# EAGLE schematic ledbord (EAGLE 9.6.0)
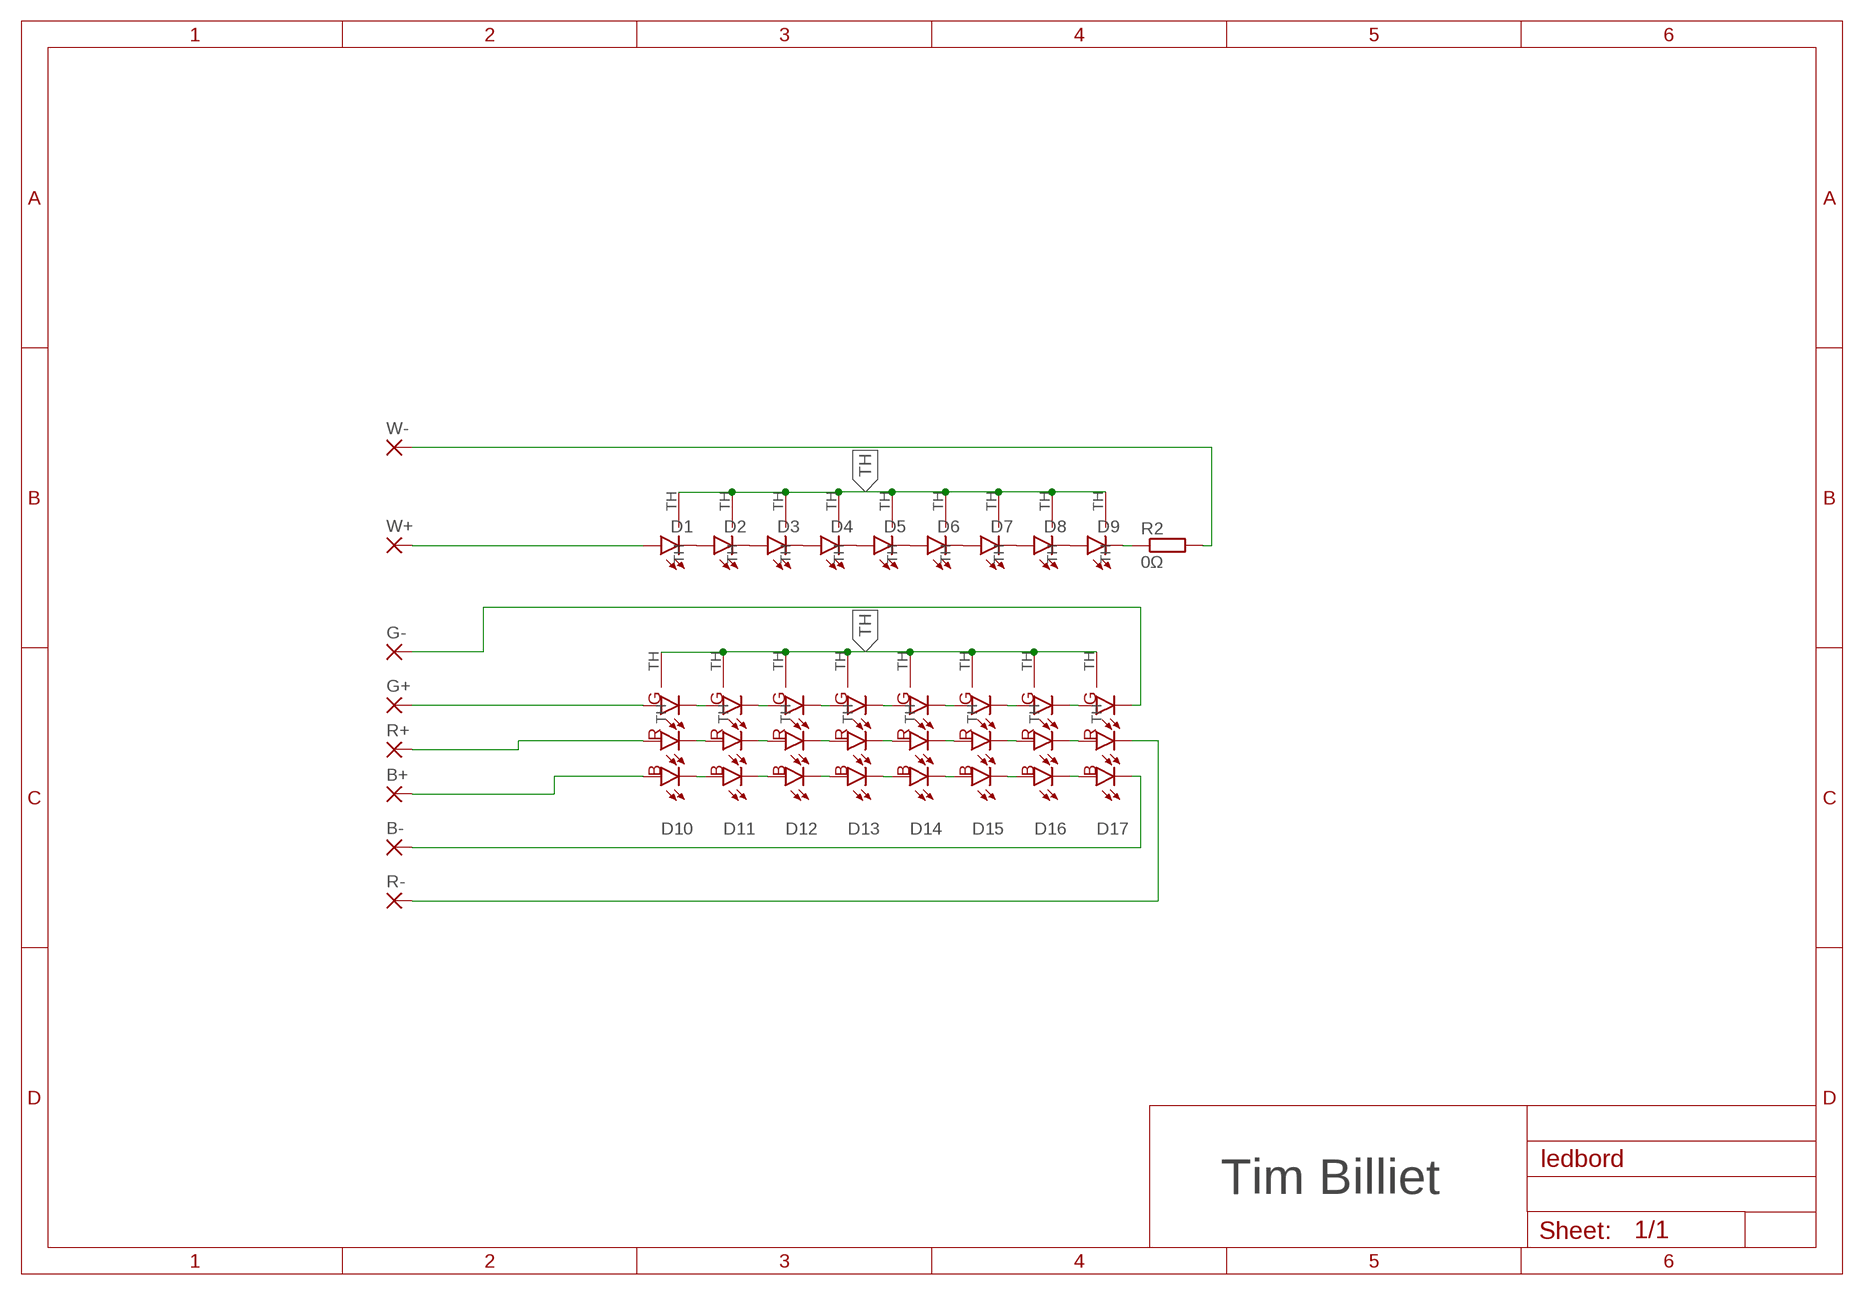
[diagram p0: schematic, sheet 1]

## Parts
B+  SMD5  [SMD2,54-5,08]
B-  SMD5  [SMD2,54-5,08]
D1  HL-C3535F77W1GA-LED  [HL-C3535F77W1GA-LED]
D2  HL-C3535F77W1GA-LED  [HL-C3535F77W1GA-LED]
D3  HL-C3535F77W1GA-LED  [HL-C3535F77W1GA-LED]
D4  HL-C3535F77W1GA-LED  [HL-C3535F77W1GA-LED]
D5  HL-C3535F77W1GA-LED  [HL-C3535F77W1GA-LED]
D6  HL-C3535F77W1GA-LED  [HL-C3535F77W1GA-LED]
D7  HL-C3535F77W1GA-LED  [HL-C3535F77W1GA-LED]
D8  HL-C3535F77W1GA-LED  [HL-C3535F77W1GA-LED]
D9  HL-C3535F77W1GA-LED  [HL-C3535F77W1GA-LED]
D10  TJ-S5050UGEW5TLCBRG-A5  [TJ-S5050UGEW5TLCBRG-A5]
D11  TJ-S5050UGEW5TLCBRG-A5  [TJ-S5050UGEW5TLCBRG-A5]
D12  TJ-S5050UGEW5TLCBRG-A5  [TJ-S5050UGEW5TLCBRG-A5]
D13  TJ-S5050UGEW5TLCBRG-A5  [TJ-S5050UGEW5TLCBRG-A5]
D14  TJ-S5050UGEW5TLCBRG-A5  [TJ-S5050UGEW5TLCBRG-A5]
D15  TJ-S5050UGEW5TLCBRG-A5  [TJ-S5050UGEW5TLCBRG-A5]
D16  TJ-S5050UGEW5TLCBRG-A5  [TJ-S5050UGEW5TLCBRG-A5]
D17  TJ-S5050UGEW5TLCBRG-A5  [TJ-S5050UGEW5TLCBRG-A5]
G+  SMD5  [SMD2,54-5,08]
G-  SMD5  [SMD2,54-5,08]
R2  0Ω  R-EU_R2512  [R2512]
R+  SMD5  [SMD2,54-5,08]
R-  SMD5  [SMD2,54-5,08]
W+  SMD5  [SMD2,54-5,08]
W-  SMD5  [SMD2,54-5,08]

## Nets
B+: B+.1(P) D10.P6(6B+)
B-: B-.1(P) D17.P1(1B-)
G+: D10.P4(4G+) G+.1(P)
G-: D17.P3(3G-) G-.1(P)
N$1: D1.P$2(C) D2.P$1(A)
N$2: D2.P$2(C) D3.P$1(A)
N$3: D3.P$2(C) D4.P$1(A)
N$4: D4.P$2(C) D5.P$1(A)
N$5: D5.P$2(C) D6.P$1(A)
N$6: D6.P$2(C) D7.P$1(A)
N$7: D7.P$2(C) D8.P$1(A)
N$8: D8.P$2(C) D9.P$1(A)
N$9: D10.P3(3G-) D11.P4(4G+)
N$10: D11.P3(3G-) D12.P4(4G+)
N$11: D12.P3(3G-) D13.P4(4G+)
N$12: D13.P3(3G-) D14.P4(4G+)
N$13: D14.P3(3G-) D15.P4(4G+)
N$14: D15.P3(3G-) D16.P4(4G+)
N$15: D15.P2(2R-) D16.P5(5R+)
N$16: D14.P2(2R-) D15.P5(5R+)
N$17: D13.P2(2R-) D14.P5(5R+)
N$18: D12.P2(2R-) D13.P5(5R+)
N$19: D11.P2(2R-) D12.P5(5R+)
N$20: D10.P2(2R-) D11.P5(5R+)
N$21: D10.P1(1B-) D11.P6(6B+)
N$22: D11.P1(1B-) D12.P6(6B+)
N$23: D12.P1(1B-) D13.P6(6B+)
N$24: D13.P1(1B-) D14.P6(6B+)
N$25: D14.P1(1B-) D15.P6(6B+)
N$26: D15.P1(1B-) D16.P6(6B+)
N$27: D16.P3(3G-) D17.P4(4G+)
N$28: D16.P2(2R-) D17.P5(5R+)
N$29: D16.P1(1B-) D17.P6(6B+)
N$38: D9.P$2(C) R2.1
R+: D10.P5(5R+) R+.1(P)
R-: D17.P2(2R-) R-.1(P)
TH: D1.TH D2.TH D3.TH D4.TH D5.TH D6.TH D7.TH D8.TH D9.TH D10.TH D11.TH D12.TH D13.TH D14.TH D15.TH D16.TH D17.TH
W+: D1.P$1(A) W+.1(P)
W-: R2.2 W-.1(P)

## Notes on the sheet
- Tim Billiet

## Library data of the parts
B+ B- G+ G- R+ R- W+ W- = wirepadround:SMD5: SMD PAD
D1-D9 = mijn-library:HL-C3535F77W1GA-LED: 140lm 3000K Yellow Diffused -20℃~+85℃ Positive post White light 120° 3000mW SMD3535 Light Emitting Diodes
D10-D17 = mijn-library:TJ-S5050UGEW5TLCBRG-A5
R2 = rcl:R-EU_: RESISTOR, European symbol; SPICEPREFIX: R